# Altium schematic sheet holiday_detector.SchDoc: HOLIDAY DETECTOR
size A4; Engineer: DMH; Address1: DETEX CORP; Address2: 302 DETEX DR; Address3: NEW BRAUNFELS, TX; DocumentNumber: N/A; Revision: A0; SheetNumber: 1; SheetTotal: 1; DocumentName: HOLIDAY DETECTOR
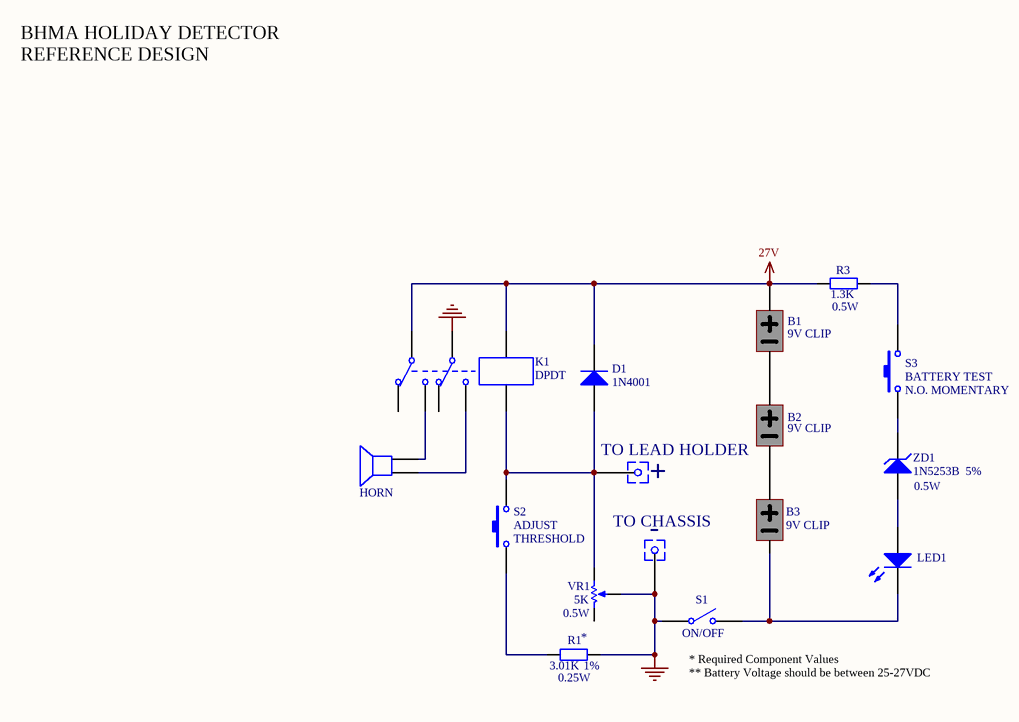
[diagram p0: holiday_detector.SchDoc]

## Parts
+  TP_80_MIL  [TP_80_MIL]  (value not drawn)
-_CHASSIS  TP_80_MIL  [TP_80_MIL]  (value not drawn)
B1  9V CLIP  [BATT_CLIP]
B2  9V CLIP  [BATT_CLIP]
B3  9V CLIP  [BATT_CLIP]
D1  1N4001  [DO-41]
HORN  Speaker  [BUZZER]  (value not drawn)
K1  DPDT  [OM_G2R]
LED1  T-1 3/4  [LED_2]  (value not drawn)
R1  value 3.01K  Tolerance: 1%  Power Rating: 0.25W  [AXIAL-0.4]  (hidden comment: Res2)
R3  value 1.3K  Power Rating: 0.5W  [AXIAL-0.4]  (hidden comment: Res2)
S1  ON/OFF  [SPDT_PCB - duplicate]
S2  ADJUST  [SPST-2]
S3  BATTERY TEST  TYPE: N.O. MOMENTARY  [SPST-2]
VR1  value 5K  Power Rating: 0.5W  [JMP3]  (hidden comment: RPot)
ZD1  VOLTAGE: 1N5253B  Tolerance: 5%  POWER RATING: 0.5W  [ZENER_1_WATT]  (hidden comment: *)

## Nets
27V: B1.1(POS) D1.2(K) K1.3 K1.8 R3.2
GND: -_CHASSIS.1 K1.6 R1.2 S1.1(COMMON) VR1.3(TAP)
Net+_1: +.1 D1.1(A) K1.1 S2.1 VR1.1(TOP)
NetB1_2: B1.2(NEG) B2.1(POS)
NetB2_2: B2.2(NEG) B3.1(POS)
NetB3_2: B3.2(NEG) LED1.2(K) S1.2(NO)
NetHORN_1: HORN.1 K1.4
NetHORN_2: HORN.2 K1.5
NetLED1_1: LED1.1(A) ZD1.1(A)
NetR1_1: R1.1 S2.2
NetR3_1: R3.1 S3.1
NetS3_2: S3.2 ZD1.2(K)

Not connected (* = marked no-connect by the designer): K1 2 7; VR1 2(BOT)

## Notes on the sheet
- BHMA HOLIDAY DETECTOR
  REFERENCE DESIGN
- (near +) TO LEAD HOLDER
- (near -_CHASSIS) TO CHASSIS
- (near S2) THRESHOLD
- (near -_CHASSIS) -
- (near R1) *
- (near S1) * Required Component Values
  ** Battery Voltage should be between 25-27VDC
- Title
- Size:
- Date:
- A4
- Number:
- Time:
- Revision:
- Sheet
- of
- File:

## Library data of the parts
B1-B3 = BATT_CLIP: PCB MOUNT 9V BATTERY CLIP; MFR: KEYSTONE; P/N: 1291-66
D1 = Diode 1N4001: 1 Amp General Purpose Rectifier; PackageReference: DO-41; PackageDescription: Diode, Axial; Body 5.2 x 2.7 mm (LxDia. max), Lead Dia. 0.86 mm (max)
HORN = Speaker: Loudspeaker; Published: 24-Mar-1999; LatestRevisionDate: 17-Jul-2002; LatestRevisionNote: Re-released for DXP Platform.; PackageReference: PIN2; Publisher: Altium Limited
K1 = Relay-DPDT: Dual-Pole Dual-Throw Relay; P/N: F1CA024V; PackageDescription: Relay; 8 Leads
LED1 = LED1: Typical RED GaAs LED; Published: 8-Jun-2000; LatestRevisionDate: 08-Jul-2005; LatestRevisionNote: Mech Layer 1 removed.; PackageReference: LED-1; Publisher: Altium Limited; PackageDescription: LED; 2 Leads
R1 = Res2: Resistor; MFR PART: SFR55; MFR: PHILLIPS; PackageDescription: Axial Device, Thru-Hole; 2 Leads; 0.4 in Pin Spacing
R3 = Res2: Resistor; Tolerance: 5%; PackageDescription: Axial Device, Thru-Hole; 2 Leads; 0.4 in Pin Spacing
S1 = SW-SPST: SPST SLIDE SW; PackageReference: SPST-2; PackageDescription: Switch; 2 Leads
S2 S3 = SW-PB: TACTILE SW; Published: 24-Mar-1999; LatestRevisionDate: 17-Jul-2002; LatestRevisionNote: Re-released for DXP Platform.; PackageReference: SPST-2; Publisher: Altium Limited; PackageDescription: Switch; 2 Leads
VR1 = RPot: Potentiometer; pin to pad: 2>3 3>2; MFR PART: 308N; MFR: Clarostat; Set Position: 0.5; PackageReference: VR5; PackageDescription: Variable Resistor, Thru-Hole; 3 Leads
ZD1 = D Zener: Zener Diode; P/N: 1N5253B
+ -_CHASSIS = TP_80_MIL: Value: *